# EAGLE design light_switch_smd3 (EAGLE 7.5.0)
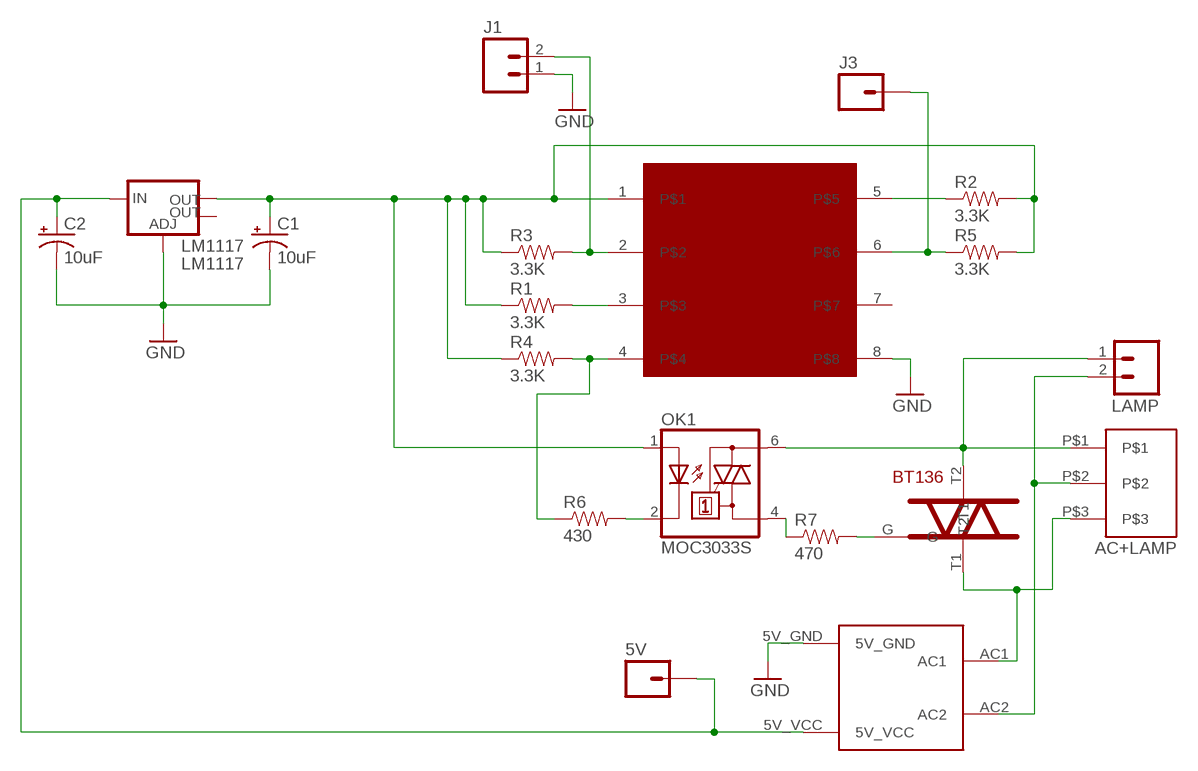
[diagram p0: schematic, sheet 1]

## Parts
5V  M01PTH  [1X01]
AC+LAMP  DG350-3.5-03P  [DG350-3.5-03P]
BT136  BT136  [BT136-PKG]
C1  10uF  10UF-6.3V-20%(0603)(TANT)"  [0603-POL]
C2  10uF  10UF-6.3V-20%(0603)(TANT)"  [0603-POL]
J1  M02PTH  [1X02]
J3  M01PTH  [1X01]
LAMP  M02PTH  [1X02]
LM1117  LM1117  V_REG_LM1117SOT223  [SOT223]
OK1  MOC3033S  [DIL6-SMD]
R1  3.3K  3.3MOHM-1/10W-1%(0603)  [0603-RES]
R2  3.3K  3.3MOHM-1/10W-1%(0603)  [0603-RES]
R3  3.3K  3.3MOHM-1/10W-1%(0603)  [0603-RES]
R4  3.3K  3.3MOHM-1/10W-1%(0603)  [0603-RES]
R5  3.3K  3.3MOHM-1/10W-1%(0603)  [0603-RES]
R6  430  RESISTOR0603  [0603-RES]
R7  470  RESISTOR0603  [0603-RES]
U$1  HI-LINK5V-ACDC  [AC5V]
U$2  ESP8266-01  [ESP8266-01]

## Nets
GND: C1.K(-) C2.K(-) J1.1 LM1117.1(ADJ) U$1.5V_GND U$2.8
N$1: J1.2 R3.2 U$2.2
N$2: R2.1 U$2.5
N$3: C1.A(+) LM1117.2(OUT) OK1.1(A) R1.1 R2.2 R3.1 R4.1 R5.2 U$2.1
N$5: OK1.2(C) R6.2
N$6: BT136.G R7.2
N$7: OK1.4(A1) R7.1
N$8: AC+LAMP.P$1 BT136.T2 LAMP.1 OK1.6(A2)
N$9: R4.2 R6.1 U$2.4
N$11: AC+LAMP.P$2 LAMP.2 U$1.AC2
N$12: AC+LAMP.P$3 BT136.T1 U$1.AC1
N$13: 5V.1 C2.A(+) LM1117.3(IN) U$1.5V_VCC
N$14: J3.1 R5.1 U$2.6
N$26: R1.2 U$2.3
Unconnected: LM1117.4(OUT) U$2.7

## Library data of the parts
5V J3 = SparkFun-Connectors:M01: Header 1 Standard 1-pin 0.1" header. Use with straight break away headers (SKU : PRT-00116), right angle break away headers (PRT-00553), swiss pins (PRT-00743), machine pins (PRT-00117), and female headers (PRT-00115). SMTSO-256-ET is a "flush mount" nut for a 4-40 screw. The older package used to be too tight, and did not allow it to sit properly thru the drill hit. The latest (0.165DIA) fits nice and snug.
AC+LAMP = myblog_library:DG350-3.5-03P: DG350-3.5-03P - terminal connector with 3.5mm step
BT136 = myblog_library:BT136
C1 C2 = SparkFun-Capacitors:10UF-6.3V-20%(0603)(TANT); PROD_ID: CAP-13210
J1 LAMP = SparkFun-Connectors:M02: Standard 2-pin 0.1" header. Use with - straight break away headers ( PRT-00116) - right angle break away headers (PRT-00553) - swiss pins (PRT-00743) - machine pins (PRT-00117) - female headers (PRT-00115) Molex polarized connector foot print use with: PRT-08233 with associated crimp pins and housings. 2.54_SCREWTERM for use with PRT-10571. 3.5mm Screw Terminal footprints for PRT-08084 5mm Screw Terminal footprints for use with PRT-08432
LM1117 = SparkFun-PowerIC:V_REG_LM1117: Voltage Regulator LM1117 Standard adjustable voltage regulator but in SMD form. Spark Fun Electronics SKU : COM-00595; PROD_ID: VREG-08170
OK1 = optocoupler:MOC30*: 6-Pin DIP Zero-Cross Optoisolators Triac Driver Output (250/400 Volt Peak) Source: Data sheet <http://www.fairchildsemi.com/ds/MO/MOC3031M.pdf> The old path of data sheet not more available 2013-05-06.; MF: FAIRCHILD SEMICONDUCTOR; MPN: MOC3033S-M; OC_FARNELL: unknown; OC_NEWARK: 05C2878
R1-R5 = SparkFun-Resistors:3.3MOHM-1/10W-1%(0603): RES-11057; PROD_ID: RES-11057
R6 R7 = SparkFun-Resistors:RESISTOR: Resistor Basic schematic elements and footprints for 0603, 1206, and PTH resistors.
U$1 = myblog_library:HI-LINK5V-ACDC
U$2 = myblog_library:ESP8266-01: This is the famous esp8266 module board

## Net classes
0 default: width 0.762 mm, drill 0.762 mm, clearance 0.762 mm

## Board
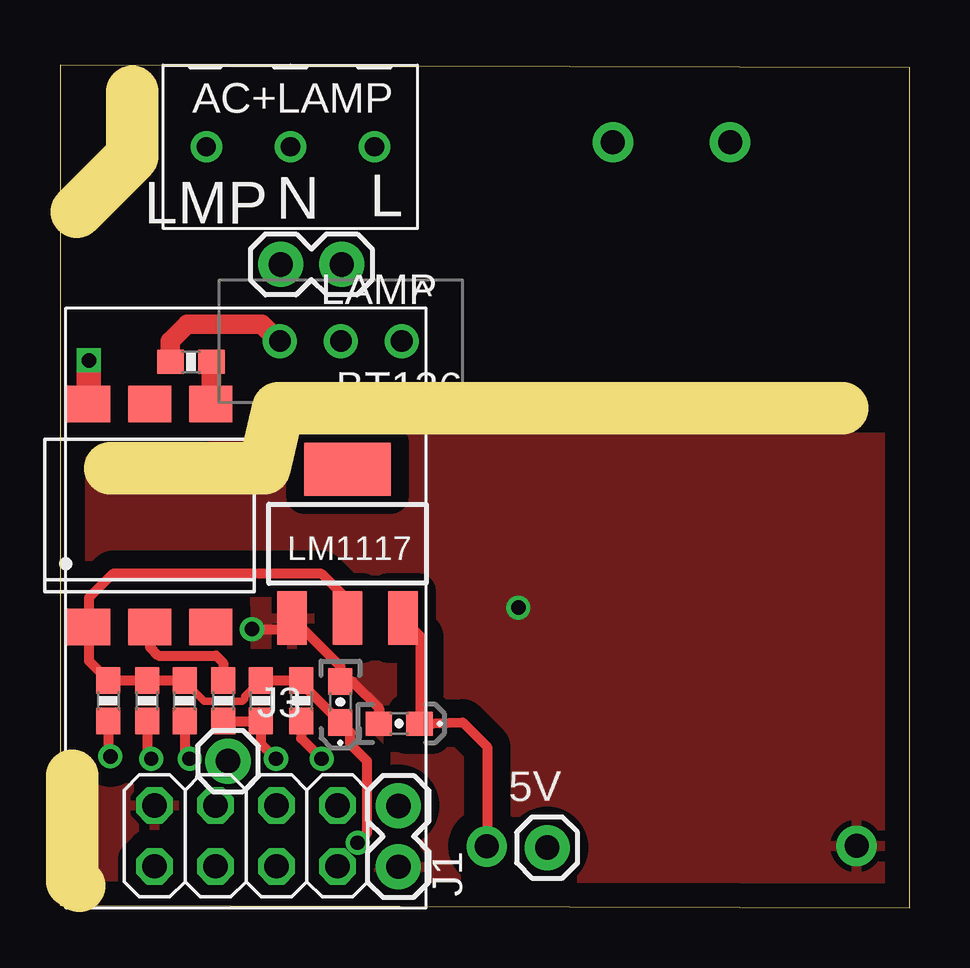
[diagram p1: board, top side]
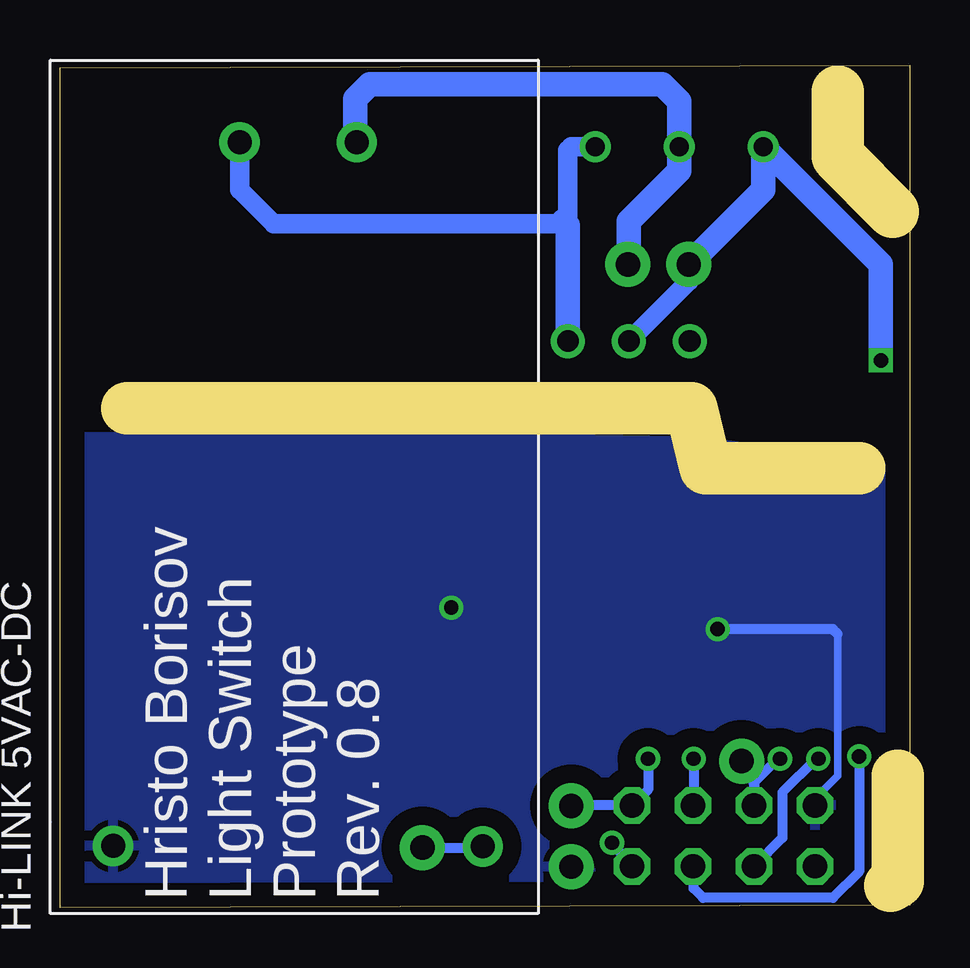
[diagram p2: board, bottom side, seen from below]

Size 35.4 x 35.1 mm. Coordinates in mm from the lower left corner, seen from the top.
Outline: 0,0.1 35.4,0 35.4,35 0,35.1 0,0.1
Copper layers (1*16): Top 0.035mm / dielectric 1.5mm / Bottom 0.035mm
Design rules "default": minimum track width 10mil, minimum drill 24mil, track to track 8mil, track to pad 8mil, pad to pad 8mil, via to via 8mil, smd to smd 8mil, copper to edge 40mil, drill to drill 8mil, minimum pad ring 10mil, minimum via ring 8mil, stop-mask expansion 4mil, vias tented up to drill 0mil, thermal gap 10mil
Milling: 7 lines

### Footprints (pad centres in the part's own frame; a part is rotated, then mirrored left to right if it is on the bottom)
1X01 = drill 1.016 pad 1.88: 1 0,0
DG350-3.5-03P = drill 0.8: P$1 -3.5,0; P$2 0,0; P$3 3.5,0
BT136-PKG = drill 0.9: G 2.54,0; T1 -2.54,0; T2 0,0
0603-POL = smd 1.1 x 1: A 0.85,0; K -0.85,0
1X02 = drill 1.016 pad 1.88: 1 0,0; 2 2.54,0
SOT223 = smd 1.219 x 2.235: 1 -2.311,-3.099; 2 0,-3.099; 3 2.311,-3.099 | smd 3.6 x 2.2: 4 0,3.099
DIL6-SMD = smd 1.78 x 1.52: 1 -2.54,-4.645; 2 0,-4.645; 3 2.54,-4.645; 4 2.54,4.645; 5 0,4.645; 6 -2.54,4.645
0603-RES = smd 1.1 x 1: 1 -0.85,0; 2 0.85,0
AC5V = drill 1 pad 1.676: 5V_GND 2.82,17.71; 5V_VCC 2.8,2.3; AC1 32.14,12.44; AC2 32.14,7.56
ESP8266-01 = drill 1.016 octagon: 1 1.81,-1.27; 2 1.81,1.27; 3 -0.73,-1.27; 4 -0.73,1.27; 5 -3.27,-1.27; 6 -3.27,1.27; 7 -5.81,-1.27; 8 -5.81,1.27

### Placement (x,y rotation side)
5V  20.3,2.5 0 top
AC+LAMP  9.6,31.7 0 top
BT136  11.7,23.6 180 top
C1  11.68,8.57 270 top
C2  14.13,7.67 0 top
J1  14.1,1.7 90 top
J3  7,6.1 0 top
LAMP  9.2,26.8 0 top
LM1117  11.98,15.16 0 top
OK1  3.74,16.33 0 top
R1  2.01,8.62 270 top
R2  3.63,8.62 90 top
R3  10.05,8.62 270 top
R4  8.37,8.62 270 top
R5  5.19,8.62 90 top
R6  6.81,8.62 90 top
R7  5.46,22.74 180 top
U$1  15.48,-0.25 90 bottom
U$2  9.75,2.99 0 top

### Tracks (layer width: path | path; a pad name or v marks a point on that pad's centre or on a via)
GND  (via drill 0.6)
  Top 0.406: v8,11.6 9.21,11.6 LM1117.1 11.68,10.05 C1.K 12.18,9.42 13.3,8.3 13.3,7.69 C2.K
  Bottom 0.305: 3.94,4.56 3,5.5 3,11.4
  Bottom 0.406: U$2.8 3.94,4.56 | 3,11.4 3.2,11.6 v8,11.6
  other vias: 19.1,12.5
  pour Bottom: -3.9,17.6 8.6,19.4 18.7,19.6 39.4,19.6 39.4,-5.6 38.9,-6.1 -2.6,-6.1 -3.6,-5.1
  pour Top: -3.6,18 10.8,19.8 21.1,19.8 34.2,19.6 39.4,19.6 39.4,-5.6 38.9,-6.1 -2.6,-6.1 -3.6,-5.1
N$1  (via drill 0.6)
  Top 0.406: R3.2 10.05,7.05 v10.9,6.2
  Bottom 0.406: v10.9,6.2 10.9,4.92 U$2.2 14.08,4.26 J1.2
N$2  (via drill 0.6 pad 0.81)
  Top 0.406: R2.1 3.63,6.37 v3.8,6.2
  Bottom 0.406: v3.8,6.2 3.9,6.2 5.3,4.8 5.3,2.9 U$2.5
N$3  (via drill 0.6)
  Top 0.305: R5.2 5.19,9.41 6,8.6 7.6,8.6 7.7,8.7 7.7,8.8 R4.1
  Top 0.406: R5.2 R2.2 R1.1 1.2,10.28 OK1.1 1.2,12.9 2.2,13.9 10.9,13.9 11.98,12.82 LM1117.2 | R4.1 R3.1 10.05,9.35 C1.A 12.1,7.3 12.1,6.8 12.8,6.1 12.8,3.1 v12.4,2.7
  Bottom 0.406: U$2.1 v12.4,2.7
N$5
  Top 0.406: OK1.2 3.74,10.86 4.1,10.5 6.5,10.5 6.8,10.2 R6.2
N$6
  Top 0.813: BT136.G 9.1,23.6 8.4,24.3 5.3,24.3 4.6,23.6 R7.2
N$7
  Top 0.813: R7.1 6.31,21 OK1.4
N$8  (via drill 0.6)
  Top 1.016: OK1.6 v1.2,22.8
  Bottom 0.813: BT136.T2 9.2,26.1 LAMP.1
  Bottom 1.016: v1.2,22.8 1.2,26.8 AC+LAMP.P$1 6.1,29.9 LAMP.1
N$9  (via drill 0.6)
  Top 0.406: R6.1 R4.2 8.37,6.83 v9,6.2
  Bottom 0.406: v9,6.2 9,4.28 U$2.4
N$11
  Bottom 1.016: U$1.AC2 23.1,31.95 23.1,33.7 22.5,34.3 10.3,34.3 9.6,33.6 AC+LAMP.P$2 9.6,30.7 11.7,28.6 11.7,26.84 LAMP.2
N$12
  Bottom 0.813: AC+LAMP.P$3 14.1,31.7 14.24,31.56 14.24,28.8 14.42,28.62 14.54,28.5 26.5,28.5 27.92,29.92 U$1.AC1
  Bottom 1.016: BT136.T1 14.24,28.44 14.42,28.62
N$13
  Top 0.406: U$1.5V_VCC 17.8,2.57 17.8,6.7 16.78,7.72 C2.A 15,7.69 15,11.3 14.29,12.01 LM1117.3
  Bottom 0.406: 5V.1 17.78,2.5 U$1.5V_VCC
N$14  (via drill 0.6)
  Top 0.406: R5.1 5.19,6.41 v5.4,6.2
  Bottom 0.406: v5.4,6.2 5.5,6.2 6.5,5.2 6.5,4.28 U$2.6 6.48,6.1 J3.1
N$16  (via drill 0.6)
  other vias: 12.4,2.7
N$26  (via drill 0.6)
  Top 0.406: R1.2 2.01,6.39 v2.1,6.3
  Bottom 0.406: v2.1,6.3 2.1,1.5 3.2,0.4 8.6,0.4 9,0.8 9,1.7 U$2.3

### Text on the board
tNames: LMP | N | L
bNames: Hristo Borisov / Light Switch / Prototype / Rev. 0.8